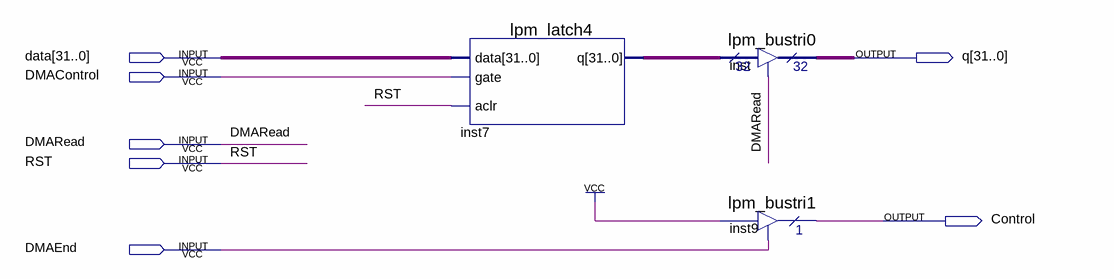
[diagram p0: schematic sheet]
// Quartus schematic DMA.bdf as structural Verilog: 3 symbols, 7 pins
module DMA (
  input  [31:0] data,
  input  DMAControl,
  input  DMARead,
  input  RST,
  input  DMAEnd,
  output [31:0] q,
  output Control
);

  wire [31:0] inst7_q;

  lpm_latch4 inst7 (.data(data), .gate(DMAControl), .aclr(RST), .q(inst7_q));
  lpm_bustri0 inst (.enabledt(DMARead), .data(inst7_q), .tridata(q));
  lpm_bustri1 inst9 (.enabledt(DMAEnd), .data(1'b1), .tridata(Control));
endmodule
